# EAGLE design UniSeb8266 (EAGLE 7.7.0)
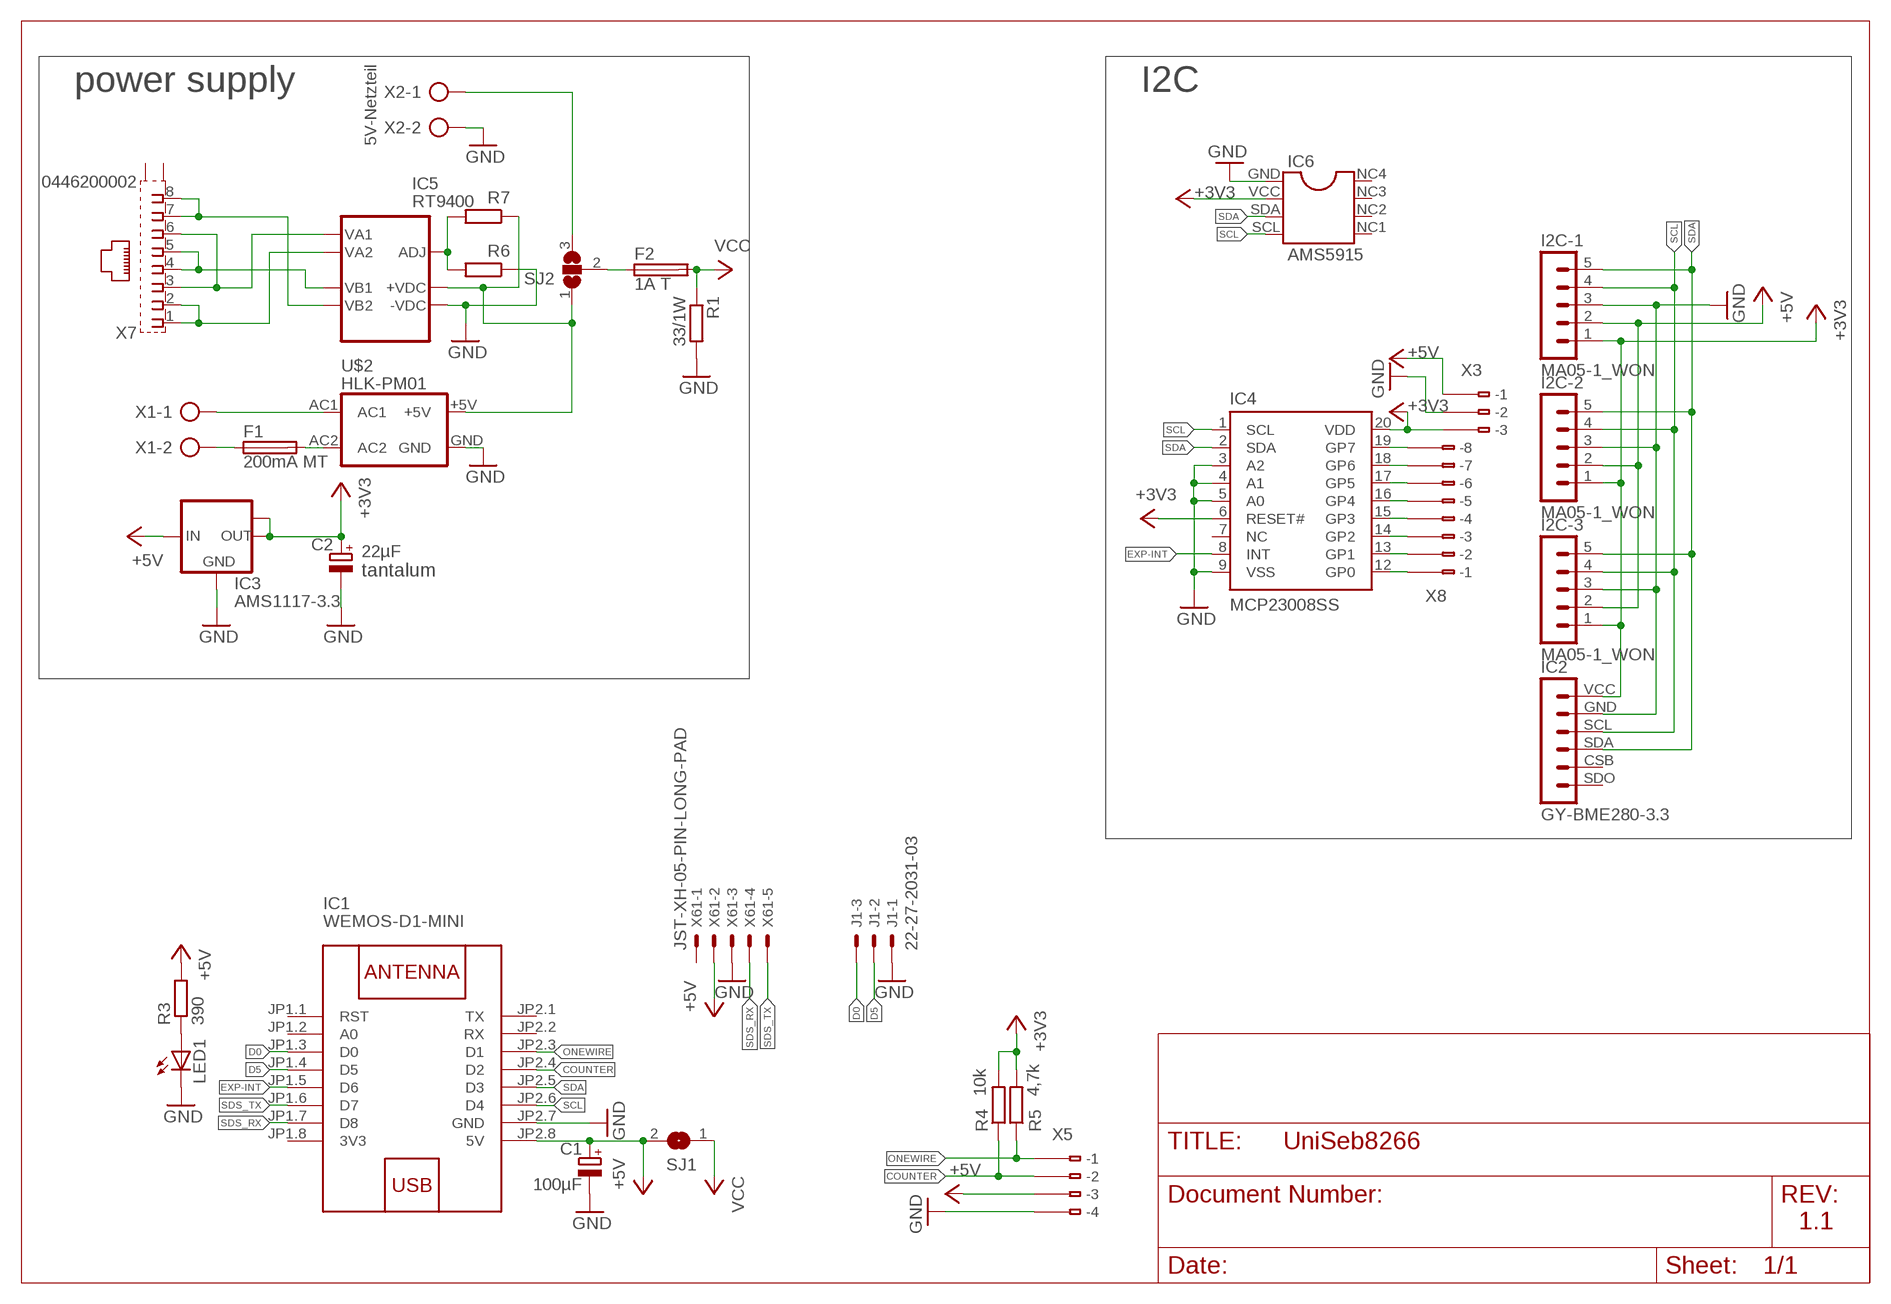
[diagram p0: schematic, sheet 1]

## Parts
C1  100µF  CPOL-EUE2.5-6  [E2,5-6]
C2  22µF  CPOL-EUE2.5-6  [E2,5-6]
F1  200mA MT  TR5  [TR5]
F2  1A T  TR5  [TR5]
I2C-1  MA05-1_WON  [MA05-1_WON]
I2C-2  MA05-1_WON  [MA05-1_WON]
I2C-3  MA05-1_WON  [MA05-1_WON]
IC1  WEMOS-D1-MINI  [WEMOS-D1-MINI]
IC2  GY-BME280-3.3  [GY-BME280-3.3]
IC3  AMS1117-3.3  LM1117IMPX-3.3  [SOT223]
IC4  MCP23008SS  [SSOP20]
IC5  RT9400  [RT9400]
IC6  AMS5915  [AMS5915]
J1  22-27-2031-03  [6410-03]
LED1  LED3MM  [LED3MM]
R1  33/1W  R-EU_0613/5V  [P0613V]
R3  390  R-EU_R1206  [R1206]
R4  10k  R-EU_R1206  [R1206]
R5  4,7k  R-EU_R1206  [R1206]
R6  R-EU_R1206  [R1206]
R7  R-EU_R1206  [R1206]
SJ1  SJ  [SJ]
SJ2  SJ2W  [SJ_2]
U$2  HLK-PM01  [HLK-PM01]
X1  AK500/2  [AK500/2]
X2  AK500/2  [AK500/2]
X3  233-503  [233-503]
X5  233-504  [233-504]
X7  0446200002  [0446200002]
X8  233-508  [233-508]
X61  JST-XH-05-PIN-LONG-PAD  [JST-XH-05-PACKAGE-LONG-PAD]

## Nets
+3V3: C2.+ I2C-1.1 I2C-2.1 I2C-3.1 IC2.VCC IC3.2(OUT) IC3.TAB(OUT1) IC4.6(RESET#) IC4.20(VDD) IC6.VCC R4.2 R5.2 X3.B3(B-3)
+5V: C1.+ I2C-1.2 I2C-2.2 I2C-3.2 IC1.JP2.8(5V) IC3.3(IN) R3.2 SJ1.2 X3.B1(B-1) X5.B3(B-3) X61.2
COUNTER: IC1.JP2.4(D2) R4.1 X5.B2(B-2)
D0: IC1.JP1.3(D0) J1.3
D5: IC1.JP1.4(D5) J1.2
EXP-INT: IC1.JP1.5(D6) IC4.8(INT)
GND: C1.- C2.- I2C-1.3 I2C-2.3 I2C-3.3 IC1.JP2.7(GND) IC2.GND IC3.1(GND) IC4.3(A2) IC4.4(A1) IC4.5(A0) IC4.9(VSS) IC5.P$5(-VDC) IC6.GND J1.1 LED1.K(C) R1.2 R6.1 U$2.GND X2.2 X3.B2(B-2) X5.B4(B-4) X61.3
N$1: F1.1 X1.2
N$2: F1.2 U$2.AC2
N$3: U$2.AC1 X1.1
N$4: IC5.P$4(VB2) X7.7 X7.8
N$5: F2.1 SJ2.2
N$6: SJ2.3 X2.1
N$7: IC5.P$6(+VDC) R7.1 SJ2.1 U$2.+5V
N$8: IC4.19(GP7) X8.B8(B-8)
N$9: IC4.12(GP0) X8.B1(B-1)
N$10: IC4.13(GP1) X8.B2(B-2)
N$11: IC4.14(GP2) X8.B3(B-3)
N$12: IC4.15(GP3) X8.B4(B-4)
N$13: IC4.16(GP4) X8.B5(B-5)
N$14: IC4.17(GP5) X8.B6(B-6)
N$15: IC4.18(GP6) X8.B7(B-7)
N$16: IC5.P$3(VB1) X7.4 X7.5
N$17: IC5.P$2(VA2) X7.1 X7.2
N$18: IC5.P$1(VA1) X7.3 X7.6
N$19: LED1.A R3.1
N$21: IC5.P$7(ADJ) R6.2 R7.2
ONEWIRE: IC1.JP2.3(D1) R5.1 X5.B1(B-1)
SCL: I2C-1.4 I2C-2.4 I2C-3.4 IC1.JP2.6(D4) IC2.SCL IC4.1(SCL) IC6.SCL
SDA: I2C-1.5 I2C-2.5 I2C-3.5 IC1.JP2.5(D3) IC2.SDA IC4.2(SDA) IC6.SDA
SDS_RX: IC1.JP1.7(D8) X61.4
SDS_TX: IC1.JP1.6(D7) X61.5
VCC: F2.2 R1.1 SJ1.1
Unconnected: IC1.JP1.1(RST) IC1.JP1.2(A0) IC1.JP2.1(TX) IC1.JP2.2(RX) IC2.CSB IC2.SDO IC4.7(NC) IC6.NC1 IC6.NC2 IC6.NC3 IC6.NC4 X3.A1(-1) X3.A2(-2) X3.A3(-3) X5.A1(-1) X5.A2(-2) X5.A3(-3) X5.A4(-4) X7.S@1(S1) X7.S@2(S2) X8.A1(-1) X8.A2(-2) X8.A3(-3) X8.A4(-4) X8.A5(-5) X8.A6(-6) X8.A7(-7) X8.A8(-8) X61.1

## Notes on the sheet
- power supply | I2C
- 5V-Netzteil
- tantalum
- 1.1

## Power pins joined to a net without a drawn wire
3V3: IC1.JP1.8(3V3)

## Library data of the parts
C1 C2 = rcl:CPOL-EU: POLARIZED CAPACITOR, European symbol
F1 F2 = fuse:TR5: FUSE Wickmann; OC_FARNELL: unknown; OC_NEWARK: unknown
I2C-1-I2C-3 = con-lstb:MA05-1_WON
IC1 = diy-modules:WEMOS-D1-MINI: WEMOS D1 mini: Mini Wi-Fi Board based on ESP-8266 device More details can be found here: https://www.wemos.cc/product/d1-mini.html Click here to find device on ebay.com <http://www.ebay.com/sch/wemos+d1+mini+nodemcu>
IC2 = GY-BME280:GY-BME280-3.3
IC3 = lm1117:LM1117IMPX-*
IC4 = microchip-dspic:MCP23008: 8-Bit I/O Expander with I2C Interface
IC5 = POE-Module:RT9400
IC6 = Amsys:AMS5915
J1 = con-molex:22-?-03: CONNECTOR wire to board 2.54 mm (.1 inch) pitch header; OC_FARNELL: unknown; OC_NEWARK: unknown
LED1 = led:LED: LED OSRAM: - CHIPLED LG R971, LG N971, LY N971, LG Q971, LY Q971, LO R971, LY R971 LH N974, LH R974 LS Q976, LO Q976, LY Q976 LO Q996 - Hyper CHIPLED LW Q18S LB Q993, LB Q99A, LB R99A - SideLED LS A670, LO A670, LY A670, LG A670, LP A670 LB A673, LV A673, LT A673, LW A673 LH A674 LY A675 LS A676, LA A676, LO A676, LY A676, LW A676 LS A679, LY A679, LG A679 - Hyper Micro SIDELED® LS Y876, LA Y876, LO Y876, LY Y876 LT Y87S - SmartLED LW L88C, LW L88S LB L89C, LB L89S, LG L890 LS L89K, LO L89K, LY L89K LS L896, LA L896, LO L896, LY L896 - TOPLED LS T670, LO T670, LY T670, LG T670, LP T670 LSG T670, LSP T670, LSY T670, LOP T670, LYG T670 LG T671, LOG T671, LSG T671 LB T673, LV T673, LT T673, LW T673 LH T674 LS T676, LA T676, LO T676, LY T676, LB T676, LH T676, LSB T676, LW T676 LB T67C, LV T67C, LT T67C, LS T67K, LO T67K, LY T67K, LW E67C LS E67B, LA E67B, LO E67B, LY E67B, LB E67C, LV E67C, LT E67C LW T67C LS T679, LY T679, LG T679 LS T770, LO T770, LY T770, LG T770, LP T770 LB T773, LV T773, LT T773, LW T773 LH T774 LS E675, LA E675, LY E675, LS T675 LS T776, LA T776, LO T776, LY T776, LB T776 LHGB T686 LT T68C, LB T68C - Hyper Mini TOPLED® LB M676 - Mini TOPLED Santana® LG M470 LS M47K, LO M47K, LY M47K Source: http://www.osram.convergy.de LUXEON: - LUMILED® LXK2-PW12-R00, LXK2-PW12-S00, LXK2-PW14-U00, LXK2-PW14-V00 LXK2-PM12-R00, LXK2-PM12-S00, LXK2-PM14-U00 LXK2-PE12-Q00, LXK2-PE12-R00, LXK2-PE12-S00, LXK2-PE14-T00, LXK2-PE14-U00 LXK2-PB12-K00, LXK2-PB12-L00, LXK2-PB12-M00, LXK2-PB14-N00, LXK2-PB14-P00, LXK2-PB14-Q00 LXK2-PR12-L00, LXK2-PR12-M00, LXK2-PR14-Q00, LXK2-PR14-R00 LXK2-PD12-Q00, LXK2-PD12-R00, LXK2-PD12-S00 LXK2-PH12-R00, LXK2-PH12-S00 LXK2-PL12-P00, LXK2-PL12-Q00, LXK2-PL12-R00 Source: www.luxeon.com KINGBRIGHT: KA-3528ASYC Source: www.kingbright.com
R1 = resistor:R-EU_: RESISTOR, European symbol
R3-R7 = rcl:R-EU_: RESISTOR, European symbol
SJ1 = jumper:SJ: SMD solder JUMPER
SJ2 = jumper:SJ2W: SMD solder JUMPER
U$2 = HLK:HLK-PM01
X1 X2 = con-ptr500:AK500/2: CONNECTOR; OC_FARNELL: unknown; OC_NEWARK: unknown
X3 = con-wago:233-503: WAGO Cage Clamp; MF: Wago Corporation; MPN: 0233-0503; OC_FARNELL: 1777097; OC_NEWARK: 79K2049
X5 = con-wago:233-504: WAGO Cage Clamp; MF: Wago Corporation; MPN: 0233-0504; OC_FARNELL: 1777098; OC_NEWARK: 79K2050
X7 = con-molex:0446200002: RJ-45 INVERTED MODULAR JACK ASSEMBLY WITH RJ-11 KEEPOUT FEATURE Source: Data sheet <http://www.farnell.com/datasheets/73207.pdf> MOLEX 0446200002 BUCHSE, RJ45, GESCHIRMT Source: Farnell <http://de.farnell.com/molex/0446200002/buchse-rj45-geschirmt/dp/9251910?ost=9251910>; MF: MOLEX; MPN: 0446200002; OC_FARNELL: 9251910
X8 = con-wago:233-508: WAGO Cage Clamp; MF: Wago Corporation; MPN: 0233-0508; OC_FARNELL: 1777101; OC_NEWARK: 79K2053
X61 = jst_xh_connectors:JST-XH-05-PIN: JST XH Connector 2 Pin Wire to board connector. Pitch: 2,54 mm, (0.100") Number of pins: 5 Created by Rembrandt Electronics www.rembrandtelectronics.com

## Board
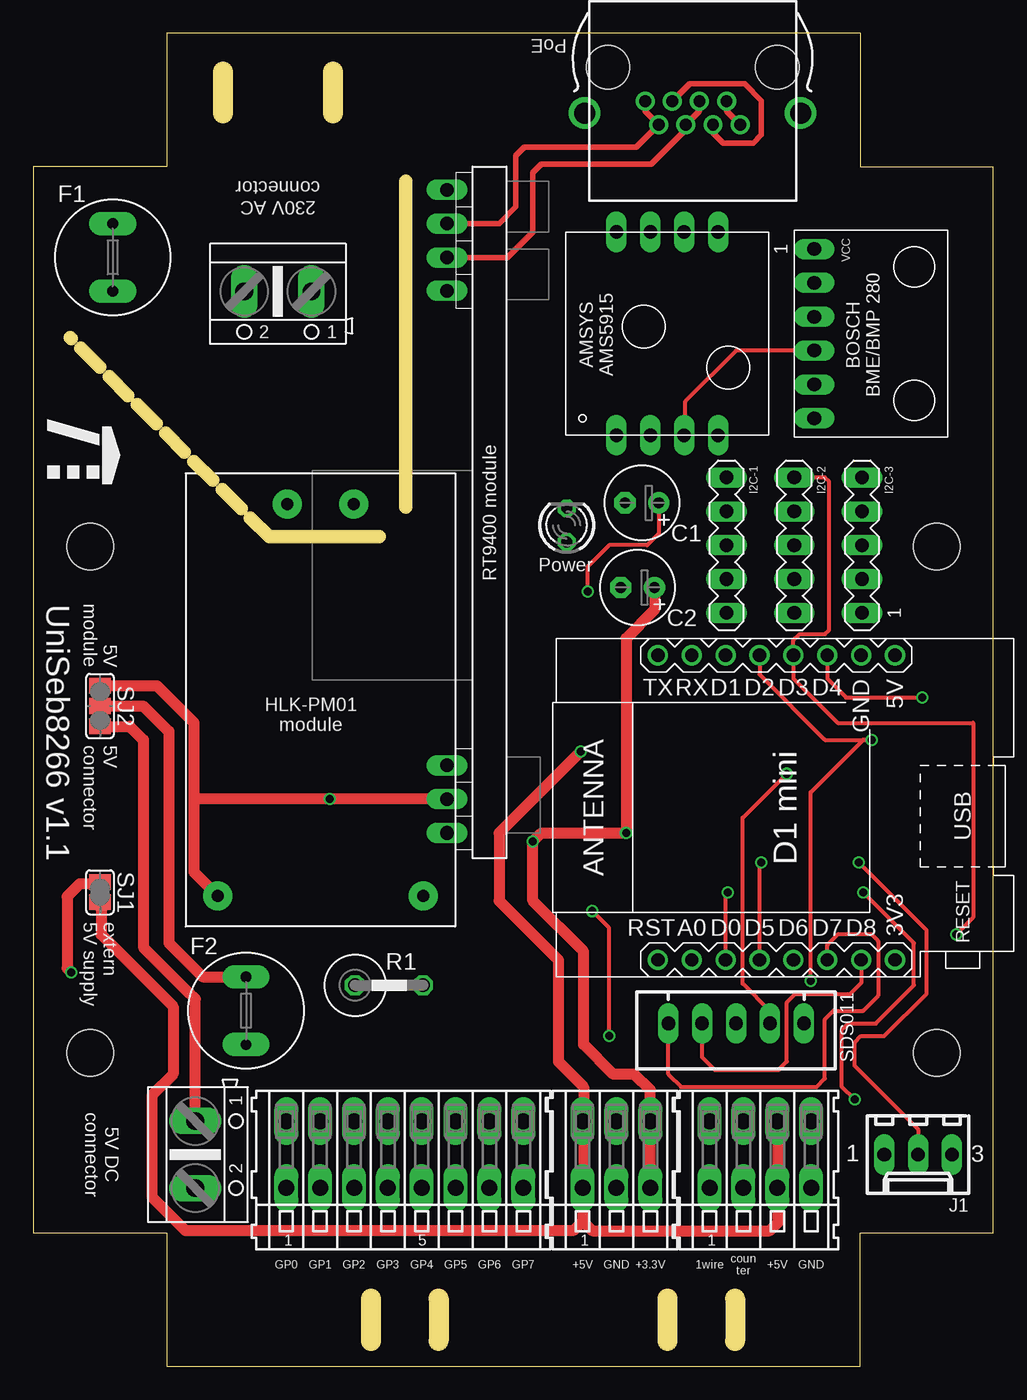
[diagram p1: board, top side]
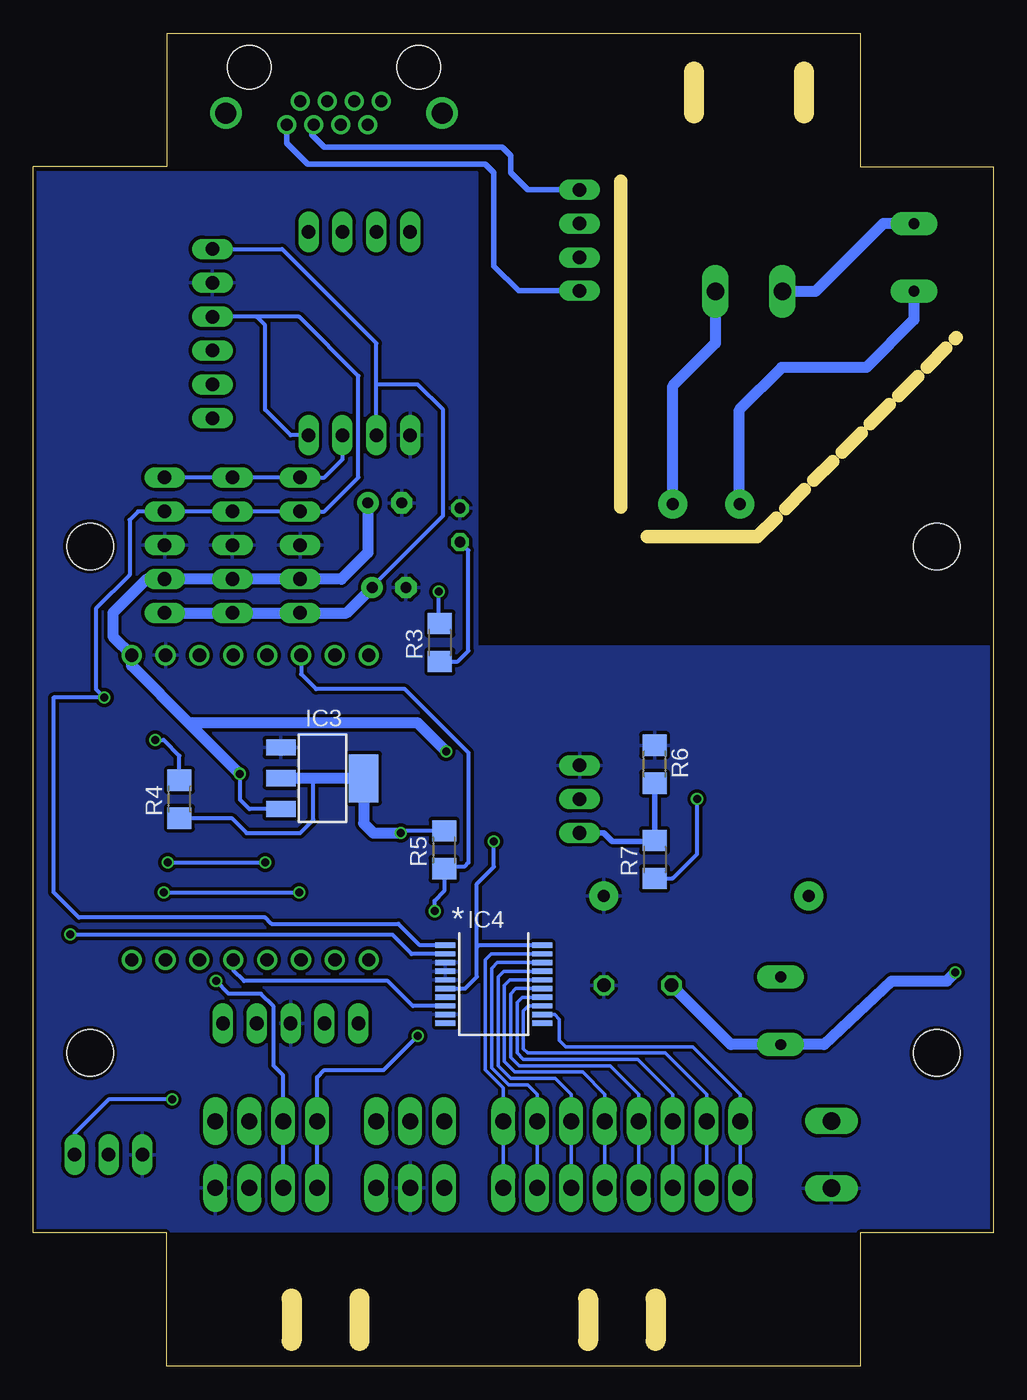
[diagram p2: board, bottom side, seen from below]

Size 72 x 100 mm. Coordinates in mm from the lower left corner, seen from the top.
Outline: 10,0 62,0 62,10 72,10 72,90 62,90 62,100 10,100 10,90 0,90 0,10 10,10 10,0
Copper layers (1*16): Top 0.035mm / dielectric 1.5mm / Bottom 0.035mm
Design rules "dirt_cheap_dirty_boards.v1 *": minimum track width 5mil, minimum drill 12mil, track to track 5mil, track to pad 5mil, pad to pad 5mil, via to via 5mil, smd to smd 0mil, copper to edge 10mil, drill to drill 10mil, minimum pad ring 10mil, minimum via ring 6mil, stop-mask expansion 2mil, vias tented up to drill 25mil, thermal gap 10mil
Holes 3.5 mm at 4.25,23.5 67.75,23.5 4.25,61.5 67.75,61.5
Milling: 16 lines

### Footprints (pad centres in the part's own frame; a part is rotated, then mirrored left to right if it is on the bottom)
E2,5-6 = drill 0.813 pad 1.6: + -1.27,0 | drill 0.813 pad 1.6 octagon: - 1.27,0
TR5 = drill 0.813 pad 1.778 long: 1 -2.54,0; 2 2.54,0
MA05-1_WON = drill 1.016 long: 1 -5.08,0; 2 -2.54,0; 3 0,0; 4 2.54,0; 5 5.08,0
WEMOS-D1-MINI = drill 1: JP1.1 -11.43,9.525; JP1.2 -11.43,6.985; JP1.3 -11.43,4.445; JP1.4 -11.43,1.905; JP1.5 -11.43,-0.635; JP1.6 -11.43,-3.175; JP1.7 -11.43,-5.715; JP1.8 -11.43,-8.255; JP2.1 11.43,9.525; JP2.2 11.43,6.985; JP2.3 11.43,4.445; JP2.4 11.43,1.905; JP2.5 11.43,-0.635; JP2.6 11.43,-3.175; JP2.7 11.43,-5.715; JP2.8 11.43,-8.255
GY-BME280-3.3 = drill 1.016 long: CSB 3.81,0.23; GND -3.81,0.23; SCL -1.27,0.23; SDA 1.27,0.23; SDO 6.35,0.23; VCC -6.35,0.23
SOT223 = smd 1.219 x 2.235: 1 -2.311,-3.099; 2 0,-3.099; 3 2.311,-3.099 | smd 3.6 x 2.2: TAB 0,3.099
SSOP20 = smd 0.4 x 1.5: 1 -2.925,-3.625; 2 -2.275,-3.625; 3 -1.625,-3.625; 4 -0.975,-3.625; 5 -0.325,-3.625; 6 0.325,-3.625; 7 0.975,-3.625; 8 1.625,-3.625; 9 2.275,-3.625; 10 2.925,-3.625; 11 2.925,3.625; 12 2.275,3.625; 13 1.625,3.625; 14 0.975,3.625; 15 0.325,3.625; 16 -0.325,3.625; 17 -0.975,3.625; 18 -1.625,3.625; 19 -2.275,3.625; 20 -2.925,3.625
RT9400 = drill 1.016 long: P$1 -3.175,50.165; P$2 -3.175,47.625; P$3 -3.175,45.085; P$4 -3.175,42.585; P$5 -3.175,6.985; P$6 -3.175,4.445; P$7 -3.175,1.905
AMS5915 = drill 1.016 long: GND 3.81,0; NC1 11.43,15.24; NC2 8.89,15.24; NC3 6.35,15.24; NC4 3.81,15.24; SCL 11.43,0; SDA 8.89,0; VCC 6.35,0
6410-03 = drill 1.016 long: 1 2.54,0; 2 0,0; 3 -2.54,0
LED3MM = drill 0.813 octagon: A -1.27,0; K 1.27,0
P0613V = drill 1.016 octagon: 1 -2.54,0; 2 2.54,0
R1206 = smd 1.6 x 1.803: 1 -1.422,0; 2 1.422,0
SJ = smd 1.168 x 1.6: 1 -0.762,0; 2 0.762,0
SJ_2 = smd 1.168 x 1.6: 1 -1.524,0; 2 0,0; 3 1.524,0
HLK-PM01 = drill 0.9 pad 2.184: +5V 31.7,2.4; AC1 2.3,12.6; AC2 2.3,7.6; GND 31.7,17.8
AK500/2 = drill 1.321 long: 1 -2.515,0; 2 2.515,0
233-503 = drill 1.2 long: A1 -2.54,2.5; A2 0,2.5; A3 2.54,2.5; B1 -2.54,-2.5; B2 0,-2.5; B3 2.54,-2.5
233-504 = drill 1.2 long: A1 -3.81,2.5; A2 -1.27,2.5; A3 1.27,2.5; A4 3.81,2.5; B1 -3.81,-2.5; B2 -1.27,-2.5; B3 1.27,-2.5; B4 3.81,-2.5
0446200002 = drill 0.889 pad 1.422: 1 3.556,2.54; 2 2.54,4.318; 3 1.524,2.54; 4 0.508,4.318; 5 -0.508,2.54; 6 -1.524,4.318; 7 -2.54,2.54; 8 -3.556,4.318 | drill 1.575 pad 2.286: S@1 -8.103,3.429; S@2 8.103,3.429 | hole 3.251: 6.35,0; -6.35,0
233-508 = drill 1.2 long: A1 -8.89,2.5; A2 -6.35,2.5; A3 -3.81,2.5; A4 -1.27,2.5; A5 1.27,2.5; A6 3.81,2.5; A7 6.35,2.5; A8 8.89,2.5; B1 -8.89,-2.5; B2 -6.35,-2.5; B3 -3.81,-2.5; B4 -1.27,-2.5; B5 1.27,-2.5; B6 3.81,-2.5; B7 6.35,-2.5; B8 8.89,-2.5
JST-XH-05-PACKAGE-LONG-PAD = drill 1.016 long: 1 -5.08,0; 2 -2.54,0; 3 0,0; 4 2.54,0; 5 5.08,0

### Placement (x,y rotation side)
C1  45.64,64.77 180 top
C2  45.32,58.42 180 top
F1  5.95,83.19 270 top
F2  15.96,26.67 270 top
I2C-1  51.99,61.59 90 top
I2C-2  57.07,61.59 90 top
I2C-3  62.15,61.59 90 top
IC1  56.37,41.91 90 top
IC2  58.34,77.47 270 top
IC3  50.33,44.11 270 bottom
IC4  37.47,28.66 270 bottom
IC5  34.21,38.1 0 top
IC6  39.92,69.85 0 top
J1  66.36,15.88 180 top
LED1  40.01,63.1 90 top
R1  26.67,28.57 0 top
R3  41.51,54.29 90 bottom
R4  61.04,42.55 270 bottom
R5  41.2,38.73 90 bottom
R6  25.4,45.16 270 bottom
R7  25.4,38.02 90 bottom
SJ1  5,35.56 270 top
SJ2  5,49.53 270 top
U$2  11.43,66.99 270 top
X1  18.34,80.64 180 top
X2  12.14,15.88 270 top
X3  43.73,15.88 0 top
X5  54.53,15.88 0 top
X7  49.45,97.45 180 top
X8  27.86,15.88 0 top
X61  52.7,25.72 180 top

### Tracks (layer width: path | path; a pad name or v marks a point on that pad's centre or on a via)
+3V3  (via drill 0.6)
  Top 0.813: X3.B3 46.27,20.72 45.09,21.91 43.5,21.91 41.27,24.13 41.27,31.11 37.47,34.92 v37.47,39.37 38.1,40.01 v44.45,40.01 44.45,54.61 46.59,56.75 C2.+
  Bottom 0.305: IC4.20 38.59,31.58 38.73,31.43 | IC4.6 39.62,28.33 38.73,29.21 38.73,31.43 | IC2.VCC 53.34,83.82 46.27,76.75 46.27,73.66 | IC6.VCC 46.27,73.66 | 46.27,73.66 43.18,73.66 41.27,71.75 41.27,63.82 46.59,58.5 C2.+ | 38.73,31.43 38.73,36.2 37.47,37.47 v37.47,39.37 | R5.2 44.3,40.16 v44.45,40.01 | R4.2 57.12,41.12 56,40 52,40 51,41 51,44.11
  Bottom 0.813: I2C-3.1 I2C-2.1 I2C-1.1 48.5,56.52 C2.+ | v44.45,40.01 v44.45,40 46.5,40 47.23,40.73 IC3.TAB 51,44.11 IC3.2
+5V  (via drill 0.6)
  Top 0.305: C1.+ 46.91,62.47 46.04,61.59 43.18,61.59 41.59,60.01 v41.59,58.1 | X61.2 55.24,26.67 53.2,28.71 53.2,41.13 v56.52,44.45
  Top 0.813: SJ1.2 5.08,34.29 5.08,32.38 10.48,26.99 10.48,21.91 8.89,20.32 8.89,12.7 11.43,10.16 40.48,10.16 41.2,10.88 | 41.2,10.88 X3.B1 41.27,13.46 41.27,20.95 39.37,22.86 39.37,30.48 34.92,34.92 34.92,40.01 v41.05,46.13 | 41.2,10.88 41.91,10.16 55.24,10.16 55.88,10.79 55.88,13.29 | 55.88,13.29 X5.B3 | 55.88,13.29 55.88,18.41
  Bottom 0.305: R3.2 41.59,55.72 v41.59,58.1 | 56.45,44.45 v56.52,44.45 56.5,44.44 56.5,42.5 55.8,41.8 IC3.3
  Bottom 0.813: 60.33,48.26 64.62,52.56 IC1.JP2.8 66.04,54.76 66.04,56.52 63.5,59.05 I2C-3.2 I2C-2.2 I2C-1.2 48.9,59.05 46.91,61.04 C1.+ | 60.33,48.26 v56.52,44.45 | v41.05,46.13 43.18,48.26 60.33,48.26
COUNTER  (via drill 0.6)
  Top 0.305: IC1.JP2.4 54.46,51.9 59.37,46.99 v62.87,46.99 62.23,46.99 58.3,43.06 v58.3,28.89
  Bottom 0.305: X5.B2 53.26,21.83 53.98,22.54 53.98,26.99 54.93,27.94 57.35,27.94 v58.3,28.89 | v62.87,46.99 62.23,46.99 61.04,45.8 R4.1
D0  (via drill 0.6)
  Top 0.305: v61.59,20 60.64,20.95 60.64,25.24 61.12,25.72 63.18,25.72 66.04,28.57 66.04,31.75 v62.23,35.56 | IC1.JP1.3 51.92,35.39 v52.07,35.56
  Bottom 0.305: v62.23,35.56 v52.07,35.56 | v61.59,20 66.36,20 68.9,17.46 J1.3
D5  (via drill 0.6)
  Top 0.305: v61.91,37.78 66.99,32.7 66.99,27.94 63.82,24.77 62.07,24.77 61.59,24.29 61.59,22.54 66.36,17.78 J1.2 | IC1.JP1.4 54.46,37.61 v54.61,37.78
  Bottom 0.305: v61.91,37.78 v54.61,37.78
EXP-INT
  Bottom 0.305: IC4.8 43.54,27.03 45.4,28.89 56.2,28.89 57,29.7 IC1.JP1.5
GND
  pour Bottom (isolate 0.254): 0,53.98 0,10.16 72.39,10.16 72.39,89.53 38.73,89.53 38.73,53.98
N$1
  Bottom 0.813: X1.2 13.34,80.64 8.89,85.09 8.57,85.41 8.26,85.72 F1.1
N$2
  Bottom 0.813: F1.2 5.95,78.5 9.53,74.93 15.88,74.93 19.05,71.75 19.05,64.71 U$2.AC2
N$3
  Bottom 0.813: X1.1 20.85,76.74 24.03,73.56 U$2.AC1
N$4
  Top 0.406: X7.7 51.99,94.15 X7.8
  Bottom 0.406: IC5.P$4 35.6,80.69 37.47,82.55 37.47,89.53 38.1,90.17 51.44,90.17 53.01,91.74 X7.8
N$5
  Top 0.813: F2.1 12.7,29.21 10.16,31.75 10.16,47.62 8.26,49.53 SJ2.2
N$6
  Top 0.813: SJ2.3 7.24,48.01 8.26,46.99 8.26,31.43 11.75,27.94 12.06,27.62 12.14,27.54 X2.1
N$7  (via drill 0.6)
  Top 0.813: 12.06,42.55 12.06,37.06 U$2.+5V | 12.06,42.55 12.06,48.26 10,50.32 9.53,50.8 9.27,51.05 SJ2.1 | IC5.P$6 v22.23,42.55 12.06,42.55
  Bottom 0.305: v22.23,42.55 22.23,38.42 24.04,36.6 R7.1
  Bottom 0.813: 25.4,36.83 R7.1
N$8
  Bottom 0.254: IC4.19 37.65,30.93 38.1,30.48 38.1,22.23 36.75,20.88 X8.B8
N$9
  Bottom 0.254: X8.B1 18.97,20.4 22.54,23.97 32.07,23.97 32.54,24.45 32.54,26.04 32.89,26.38 IC4.12
N$10
  Bottom 0.254: X8.B2 21.51,20.4 24.61,23.5 34.92,23.5 35.24,23.81 35.24,26.67 34.88,27.03 IC4.13
N$11
  Bottom 0.254: X8.B3 24.05,20.4 26.67,23.02 35.24,23.02 35.72,23.5 35.72,27.3 35.34,27.68 IC4.14
N$12
  Bottom 0.254: X8.B4 26.59,20.4 28.73,22.54 35.56,22.54 36.2,23.18 36.2,27.94 35.8,28.33 IC4.15
N$13
  Bottom 0.254: X8.B5 29.13,20.4 30.8,22.07 35.88,22.07 36.67,22.86 36.67,28.57 36.27,28.98 IC4.16
N$14
  Bottom 0.254: X8.B6 31.67,20.4 32.86,21.59 36.2,21.59 37.15,22.54 37.15,29.21 36.73,29.63 IC4.17
N$15
  Bottom 0.254: X8.B7 34.21,20.4 34.92,21.11 36.35,21.11 37.62,22.38 37.62,29.84 37.19,30.28 IC4.18
N$16
  Top 0.406: X7.5 49.96,94.15 X7.4 48.94,92.76 46.35,90.17 38.1,90.17 37.47,89.53 37.47,85.09 35.56,83.19 IC5.P$3
N$17
  Top 0.406: X7.1 45.89,94.15 X7.2 45.22,91.44 36.83,91.44 36.2,90.81 36.2,87 34.92,85.72 IC5.P$2
N$18
  Top 0.406: X7.6 50.97,92.54 51.75,91.76 53.98,91.76 54.61,92.39 54.61,94.93 53.34,96.2 49.22,96.2 X7.3
  Bottom 0.406: IC5.P$1 34.92,88.27 36.2,89.53 36.2,90.81 36.83,91.44 50.16,91.44 51.12,92.39 51.12,92.99 X7.6
N$19
  Bottom 0.305: R3.1 40.16,52.87 39.37,53.66 39.37,61.2 LED1.A
N$21
  Bottom 0.406: IC5.P$7 29.21,40.01 28.57,39.37 25.4,39.37 R7.2 R6.2
ONEWIRE  (via drill 0.6)
  Top 0.305: v43.18,24.77 43.18,32.87 v41.91,34.14
  Bottom 0.305: IC1.JP2.3 51.92,51.92 50.8,50.8 44.13,50.8 39.37,46.04 39.37,37.78 39.69,37.47 41.04,37.47 R5.1 41.2,35.64 41.91,34.92 v41.91,34.14 | X5.B1 50.72,21.67 50.16,22.23 45.72,22.23 v43.18,24.77
SCL  (via drill 0.6)
  Top 0.305: IC1.JP2.6 59.54,51.58 60.96,50.16 v66.67,50.16
  Bottom 0.305: IC4.1 43.01,31.58 44.62,33.19 54.14,33.19 54.61,33.66 68.58,33.66 70.48,35.56 70.48,50.16 v66.67,50.16 67.31,50.8 67.31,56.83 64.77,59.37 64.77,63.5 64.14,64.14 I2C-3.4 I2C-2.4 I2C-1.4 50.16,64.14 47.62,66.67 47.62,74.3 52.07,78.74 IC2.SCL 55.24,78.74 54.61,78.11 54.61,71.75 52.7,69.85 IC6.SCL
SDA  (via drill 0.6)
  Top 0.305: IC2.SDA 52.7,76.2 48.9,72.39 48.9,69.93 IC6.SDA | v69.22,32.38 70.48,33.66 70.48,48.26 60.33,48.26 57,51.58 IC1.JP2.5 57,54.46 57.47,54.93 59.37,54.93 59.69,55.24 59.69,66.36 59.37,66.67 I2C-2.5
  Bottom 0.305: IC4.2 43.63,30.93 45.09,32.38 v69.22,32.38 | IC6.SDA 48.81,68.03 50.16,66.67 I2C-1.5 I2C-2.5 I2C-3.5
SDS_RX
  Top 0.305: IC1.JP1.7 62.08,28.75 61.28,27.94 57.15,27.94 56.52,27.3 56.52,22.86 55.88,22.23 51.12,22.23 50.16,23.18 X61.4
SDS_TX
  Top 0.305: IC1.JP1.6 59.54,31.6 60.33,32.38 62.87,32.38 63.35,31.9 63.35,27.79 62.23,26.67 60.01,26.67 59.37,26.04 59.37,21.59 58.74,20.95 48.58,20.95 47.62,21.91 X61.5
VCC  (via drill 0.6)
  Top 0.813: v2.86,29.53 2.54,29.84 2.54,35.24 3.49,36.2 4.45,36.2 SJ1.1
  Bottom 0.813: R1.1 19.68,24.13 F2.2 12.7,24.13 7.62,28.89 3.49,28.89 v2.86,29.53

### Text on the board
tPlace: PoE | 230V AC / connector | VCC | AMSYS / AMS5915 | BOSCH / BME/BMP 280 | RT9400 module | Power | 1 | 5V / module | HLK-PM01 / module | 5V / connector | extern / 5V supply | SDS011 | 5V DC / connector | GP0 | GP1 | GP2 | GP3 | GP4 | GP5 | GP6 | GP7 | +5V | GND | +3.3V | 1wire | coun / ter | +5V | GND
tNames: UniSeb8266 v1.1
bNames: *